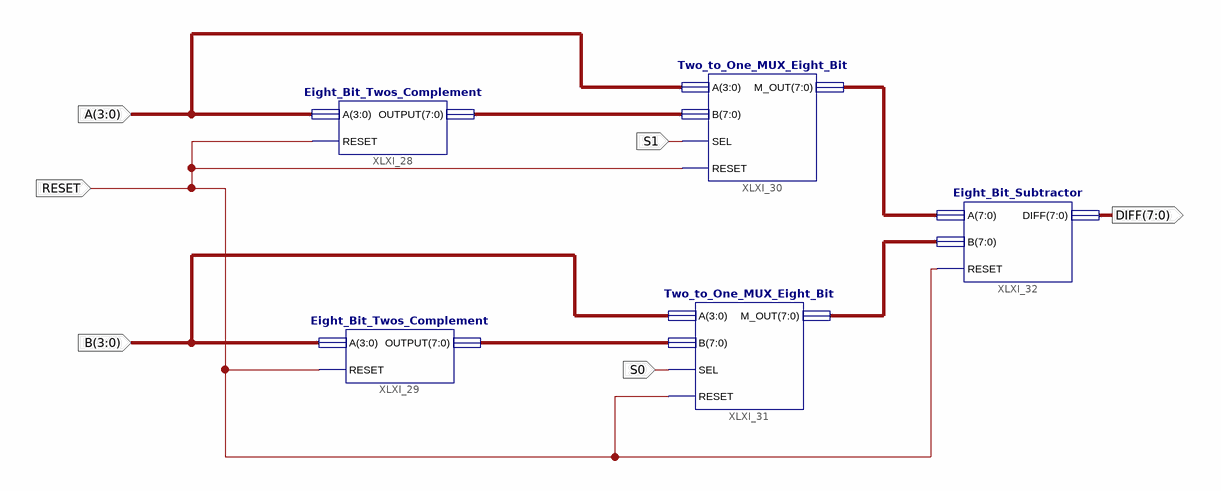
[diagram p0: schematic sheet 1]
// Xilinx ISE schematic Subtracter_Calculator.sch (spartan6) as structural Verilog: 5 symbols, 6 ports
module Subtracter_Calculator (
  input  [3:0] A,
  input  [3:0] B,
  input  RESET,
  input  S1,
  input  S0,
  output [7:0] DIFF
);

  wire [7:0] XLXN_32, XLXN_33, XLXN_36, XLXN_37;

  Eight_Bit_Twos_Complement XLXI_28 (.A(A), .OUTPUT(XLXN_33), .RESET(RESET));
  Eight_Bit_Twos_Complement XLXI_29 (.A(B), .OUTPUT(XLXN_32), .RESET(RESET));
  Two_to_One_MUX_Eight_Bit XLXI_30 (.A(A), .B(XLXN_33), .M_OUT(XLXN_36), .RESET(RESET), .SEL(S1));
  Two_to_One_MUX_Eight_Bit XLXI_31 (.A(B), .B(XLXN_32), .M_OUT(XLXN_37), .RESET(RESET), .SEL(S0));
  Eight_Bit_Subtractor XLXI_32 (.A(XLXN_36), .B(XLXN_37), .DIFF(DIFF), .RESET(RESET));
endmodule
